# EAGLE design sch (EAGLE 6.1)
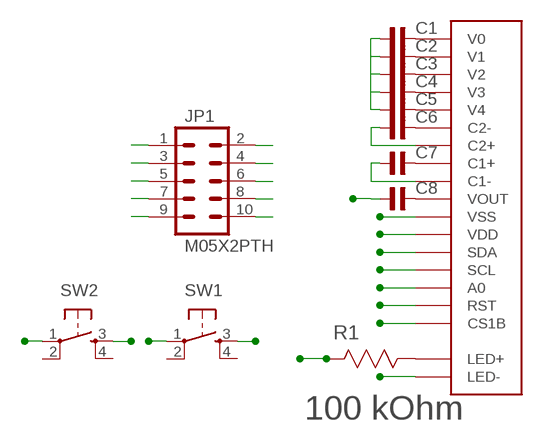
[diagram p0: schematic, sheet 1]

## Parts
C1  C-NP-SMD-0603  [C-0603]
C2  C-NP-SMD-0603  [C-0603]
C3  C-NP-SMD-0603  [C-0603]
C4  C-NP-SMD-0603  [C-0603]
C5  C-NP-SMD-0603  [C-0603]
C6  C-NP-SMD-0603  [C-0603]
C7  C-NP-SMD-0603  [C-0603]
C8  C-NP-SMD-0603  [C-0603]
JP1  M05X2PTH  [AVR_ICSP]
R1  100 kOhm  ERA-3AEB104V  [RESC1608X60N]
SW1  TAC_SWITCHPTH  [TACTILE-PTH]
SW2  TAC_SWITCHPTH  [TACTILE-PTH]
U$1  NHD-C12832A1Z-FSW-FBW-3V3  [NHD-C12832A1Z-FSW-FBW-3V3]

## Nets
A0: JP1.6 U$1.15(A0)
CS1B: JP1.10 U$1.17(CS1B)
LED+: JP1.1 R1.2(R2)
N$1: C1.2 U$1.1(V0)
N$2: C2.2 U$1.2(V1)
N$3: C3.2 U$1.3(V2)
N$4: C4.2 U$1.4(V3)
N$5: C5.2 U$1.5(V4)
N$6: C6.2 U$1.6(C2-)
N$7: C7.2 U$1.8(C1+)
N$8: C6.1 U$1.7(C2+)
N$9: C8.2 U$1.10(VOUT)
N$10: C7.1 U$1.9(C1-)
N$11: R1.1(R1) U$1.A(LED+)
RST: JP1.8 U$1.16(RST)
SCL: JP1.4 U$1.14(SCL)
SDA: JP1.2 U$1.13(SDA)
SW1: JP1.3 SW1.3
SW2: JP1.5 SW2.3
VDD: JP1.7 SW1.1 SW2.1 U$1.12(VDD)
VSS: C1.1 C2.1 C3.1 C4.1 C5.1 C8.1 JP1.9 U$1.11(VSS) U$1.K(LED-)
Unconnected: SW1.2 SW1.4 SW2.2 SW2.4

## Library data of the parts
C1-C8 = cap-pan40:C-NP: NON-POLARIZED FILM/CHIP
JP1 = SparkFun-Connectors:M05X2: Header 5x2 Standard 10-pin dual row 0.1" header. Commonly used with AVR-ISP. Use with Spark Fun Electronics SKU: PRT-00778
R1 = Panasonic_By_element14_Batch_1:ERA-3AEB104V: RESISTOR, 0603; MPN: ERA-3AEB104V; OC_FARNELL: 1811349; OC_NEWARK: 08N2096; SUPPLIER: Panasonic; TOLERANCE: ±0.1%; WATTAGE: 0.1 W
SW1 SW2 = SparkFun-Electromechanical:TAC_SWITCH: Momentary Switch Button commonly used for reset or general input. Spark Fun Electronics SKU : COM-00097
U$1 = TylersLib:NHD-C12832A1Z-FSW-FBW-3V3

## Board
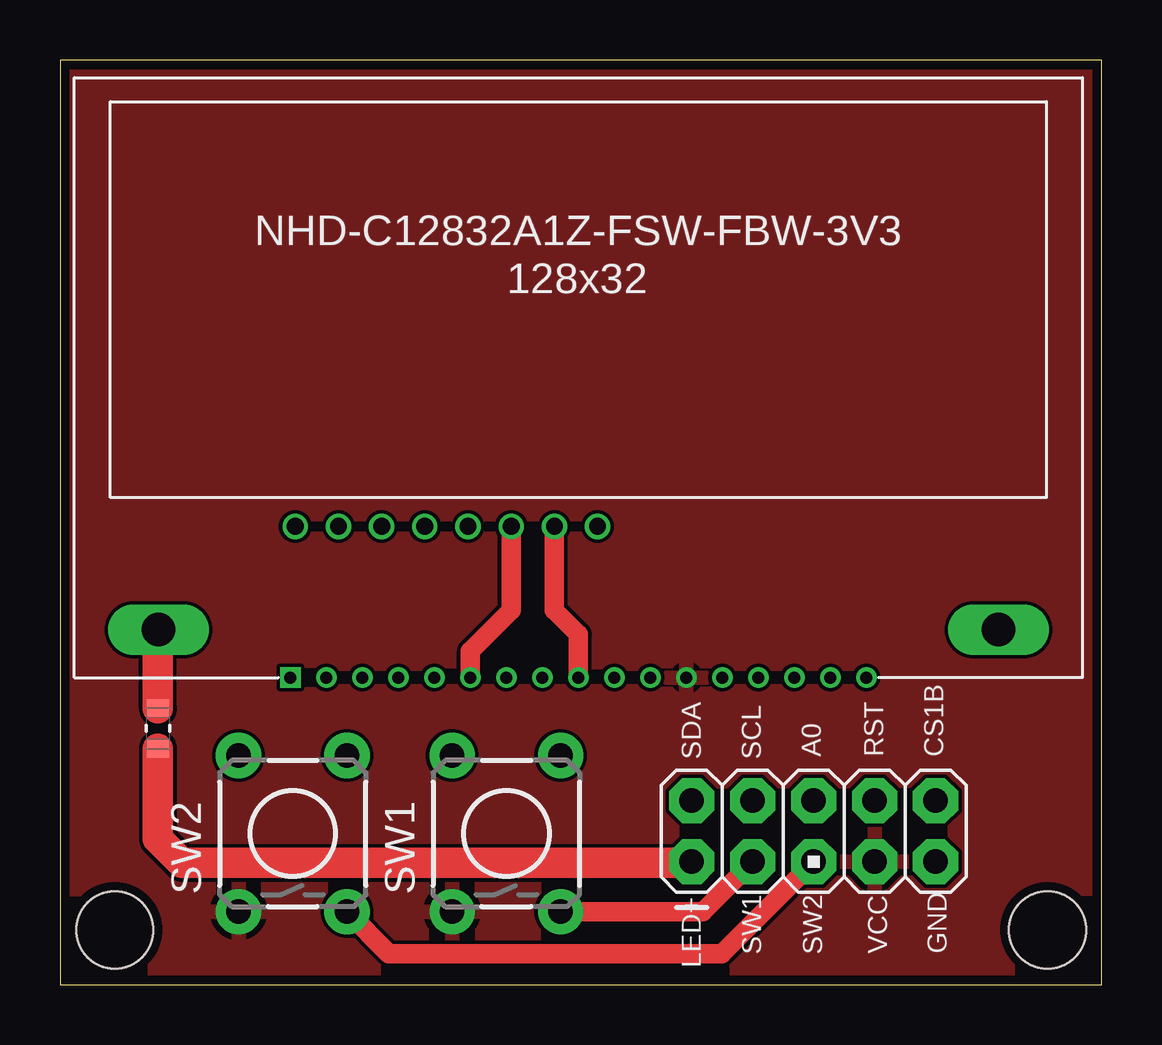
[diagram p1: board, top side]
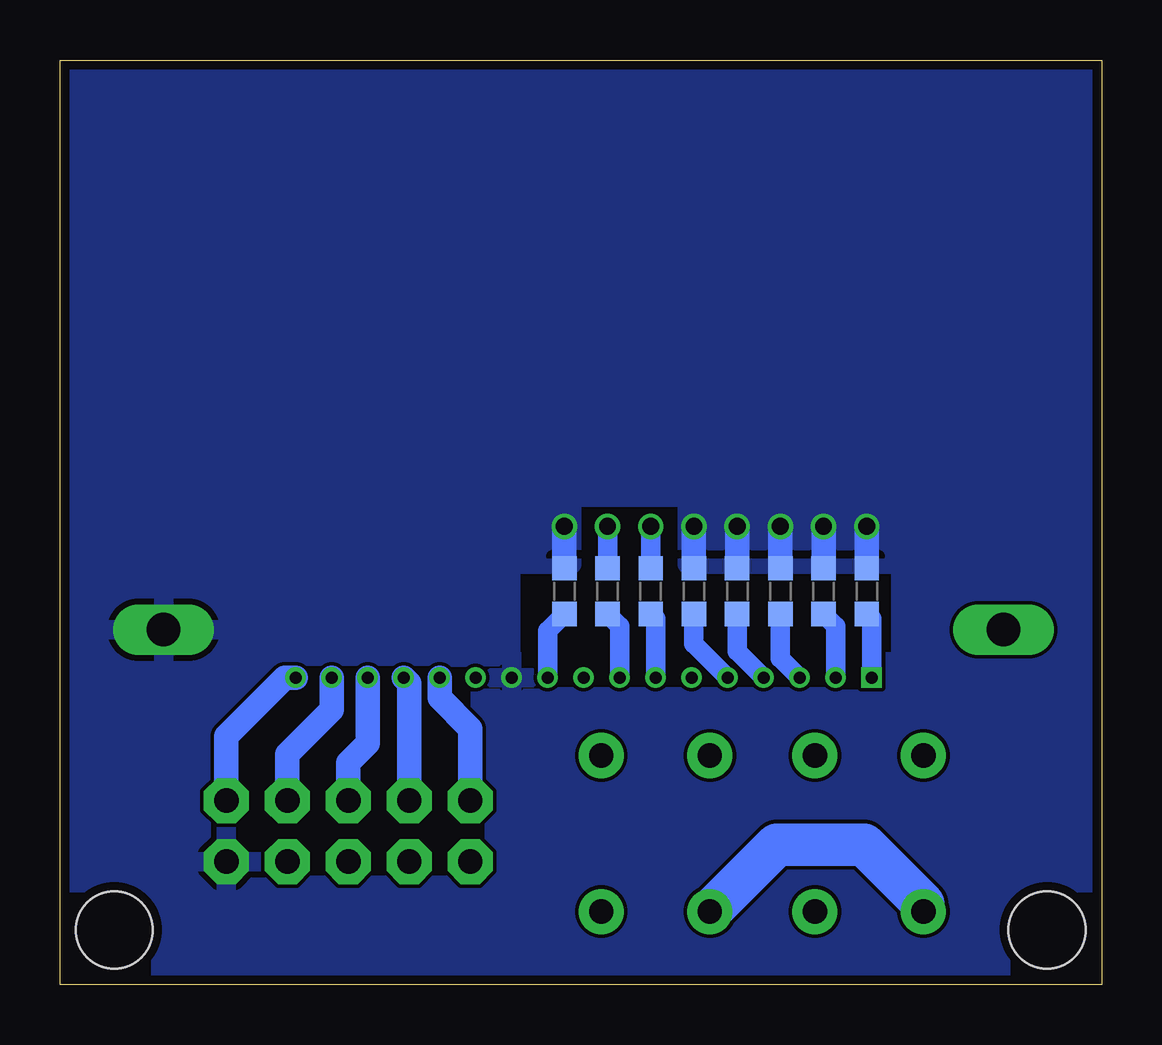
[diagram p2: board, bottom side, seen from below]

Size 43.41 x 38.53 mm. Coordinates in mm from the lower left corner, seen from the top.
Outline: 0,0 43.41,0 43.41,38.53 0,38.53 0,0
Copper layers (1*16): Top 0.0356mm / dielectric 1.5011mm / Bottom 0.0356mm
Design rules: minimum track width 6mil, minimum drill 13mil, track to track 6mil, track to pad 6mil, pad to pad 6mil, via to via 6mil, smd to smd 6mil, copper to edge 15mil, drill to drill 6mil, minimum pad ring 7mil, minimum via ring 7mil, stop-mask expansion 4mil, vias tented up to drill 0mil, thermal gap 10mil
Holes 3.2 mm at 2.29,2.29 41.15,2.29

### Footprints (pad centres in the part's own frame; a part is rotated, then mirrored left to right if it is on the bottom)
C-0603 = smd 1.016 x 1.016: 1 -0.953,0; 2 0.953,0
AVR_ICSP = drill 1.016 pad 1.88 octagon: 1 -1.27,5.08; 2 1.27,5.08; 3 -1.27,2.54; 4 1.27,2.54; 5 -1.27,0; 6 1.27,0; 7 -1.27,-2.54; 8 1.27,-2.54; 9 -1.27,-5.08; 10 1.27,-5.08
RESC1608X60N = smd 0.762 x 0.94: 1 -0.838,0; 2 0.838,0
TACTILE-PTH = drill 1.016 pad 1.88: 1 -3.251,2.261; 2 3.251,2.261; 3 -3.251,-2.261; 4 3.251,-2.261
NHD-C12832A1Z-FSW-FBW-3V3 = drill 0.5 square: 1 -12,0 | drill 0.5: 2 -10.5,0; 3 -9,0; 4 -7.5,0; 5 -6,0; 6 -4.5,0; 7 -3,0; 8 -1.5,0; 9 0,0; 10 1.5,0; 11 3,0; 12 4.5,0; 13 6,0; 14 7.5,0; 15 9,0; 16 10.5,0; 17 12,0 | drill 1.4 long: A -17.5,2; K 17.5,2

### Placement (x,y rotation side)
C1  9.8,16.4 270 bottom
C2  11.6,16.4 270 bottom
C3  13.4,16.4 270 bottom
C4  15.2,16.4 270 bottom
C5  17,16.4 270 bottom
C6  18.8,16.4 90 bottom
C7  20.6,16.4 270 bottom
C8  22.4,16.4 270 bottom
JP1  31.4,6.4 90 top
R1  4.08,10.68 270 top
SW1  18.6,6.3 90 top
SW2  9.7,6.3 90 top
U$1  21.6,12.8 0 top

### Tracks (layer width: path | path; a pad name or v marks a point on that pad's centre or on a via)
A0
  Bottom 1.016: JP1.6 31.4,9.26 30.6,10.06 U$1.15
CS1B
  Bottom 1.016: U$1.17 34.04,12.8 36.48,10.36 JP1.10
LED+
  Top 1.27: R1.2 4.08,6.08 5.08,5.08 26.27,5.08 JP1.1
N$1
  Bottom 0.813: U$1.1 9.6,15.25 C1.2
N$2
  Bottom 0.813: U$1.2 11.1,14.95 C2.2
N$3
  Bottom 0.813: C3.2 13.4,13.6 U$1.3
N$4
  Bottom 0.813: C4.2 15.2,13.9 U$1.4
N$5
  Bottom 0.813: C5.2 17,14.2 U$1.5
N$6  (via drill 0.7)
  Top 0.813: U$1.6 17.1,13.9 18.8,15.6 v18.8,19.1
  Bottom 0.813: C6.2 v18.8,19.1
N$7
  Bottom 0.813: U$1.8 20.1,14.95 C7.2
N$8
  Bottom 0.813: U$1.7 18.6,15.25 C6.1
N$9
  Bottom 0.813: U$1.10 23.1,14.75 C8.2
N$10  (via drill 0.7)
  Top 0.813: U$1.9 21.6,14.6 20.6,15.6 v20.6,19.1
  Bottom 0.813: C7.1 v20.6,19.1
N$11
  Top 1.27: R1.1 4.08,14.78 U$1.A
RST
  Bottom 1.016: JP1.8 33.94,9.61 32.1,11.45 U$1.16
SCL
  Bottom 1.016: JP1.4 28.86,12.56 U$1.14
SDA
  Bottom 1.016: JP1.2 26.32,10.67 27.6,11.95 U$1.13
SW1
  Top 0.813: SW1.3 26.78,3.05 JP1.3
SW2
  Top 0.813: SW2.3 11.96,3.04 13.7,1.3 27.57,1.3 JP1.5
VDD
  Bottom 1.778: SW2.1 7.44,3.38 9.91,5.84 13.55,5.84 SW1.1
  pour Top: 0,0 43.18,0 43.18,38.61 0,38.61
VSS  (via drill 0.7)
  Bottom 1.016: C1.1 v9.8,19.1 | C2.1 v11.6,19.1 | C3.1 v13.4,19.1 | C4.1 v15.2,19.1 | C5.1 v17,19.1 | C8.1 v22.4,19.1
  pour Bottom: -0.25,12.7 8.38,12.7 8.38,17.53 17.27,17.53 17.27,20.32 22.1,20.32 22.1,17.53 24.64,17.53 24.64,11.94 43.43,11.94 43.43,38.61 -0.25,38.61
  pour Bottom: 0,13.46 43.43,13.46 43.43,0.25 0,0.25

### Text on the board
tNames: A0 | RST | CS1B | SDA | SCL | LED+ | SW1 | SW2 | VCC | GND